# Altium schematic sheet clock-timer-8051.SchDoc
size A3
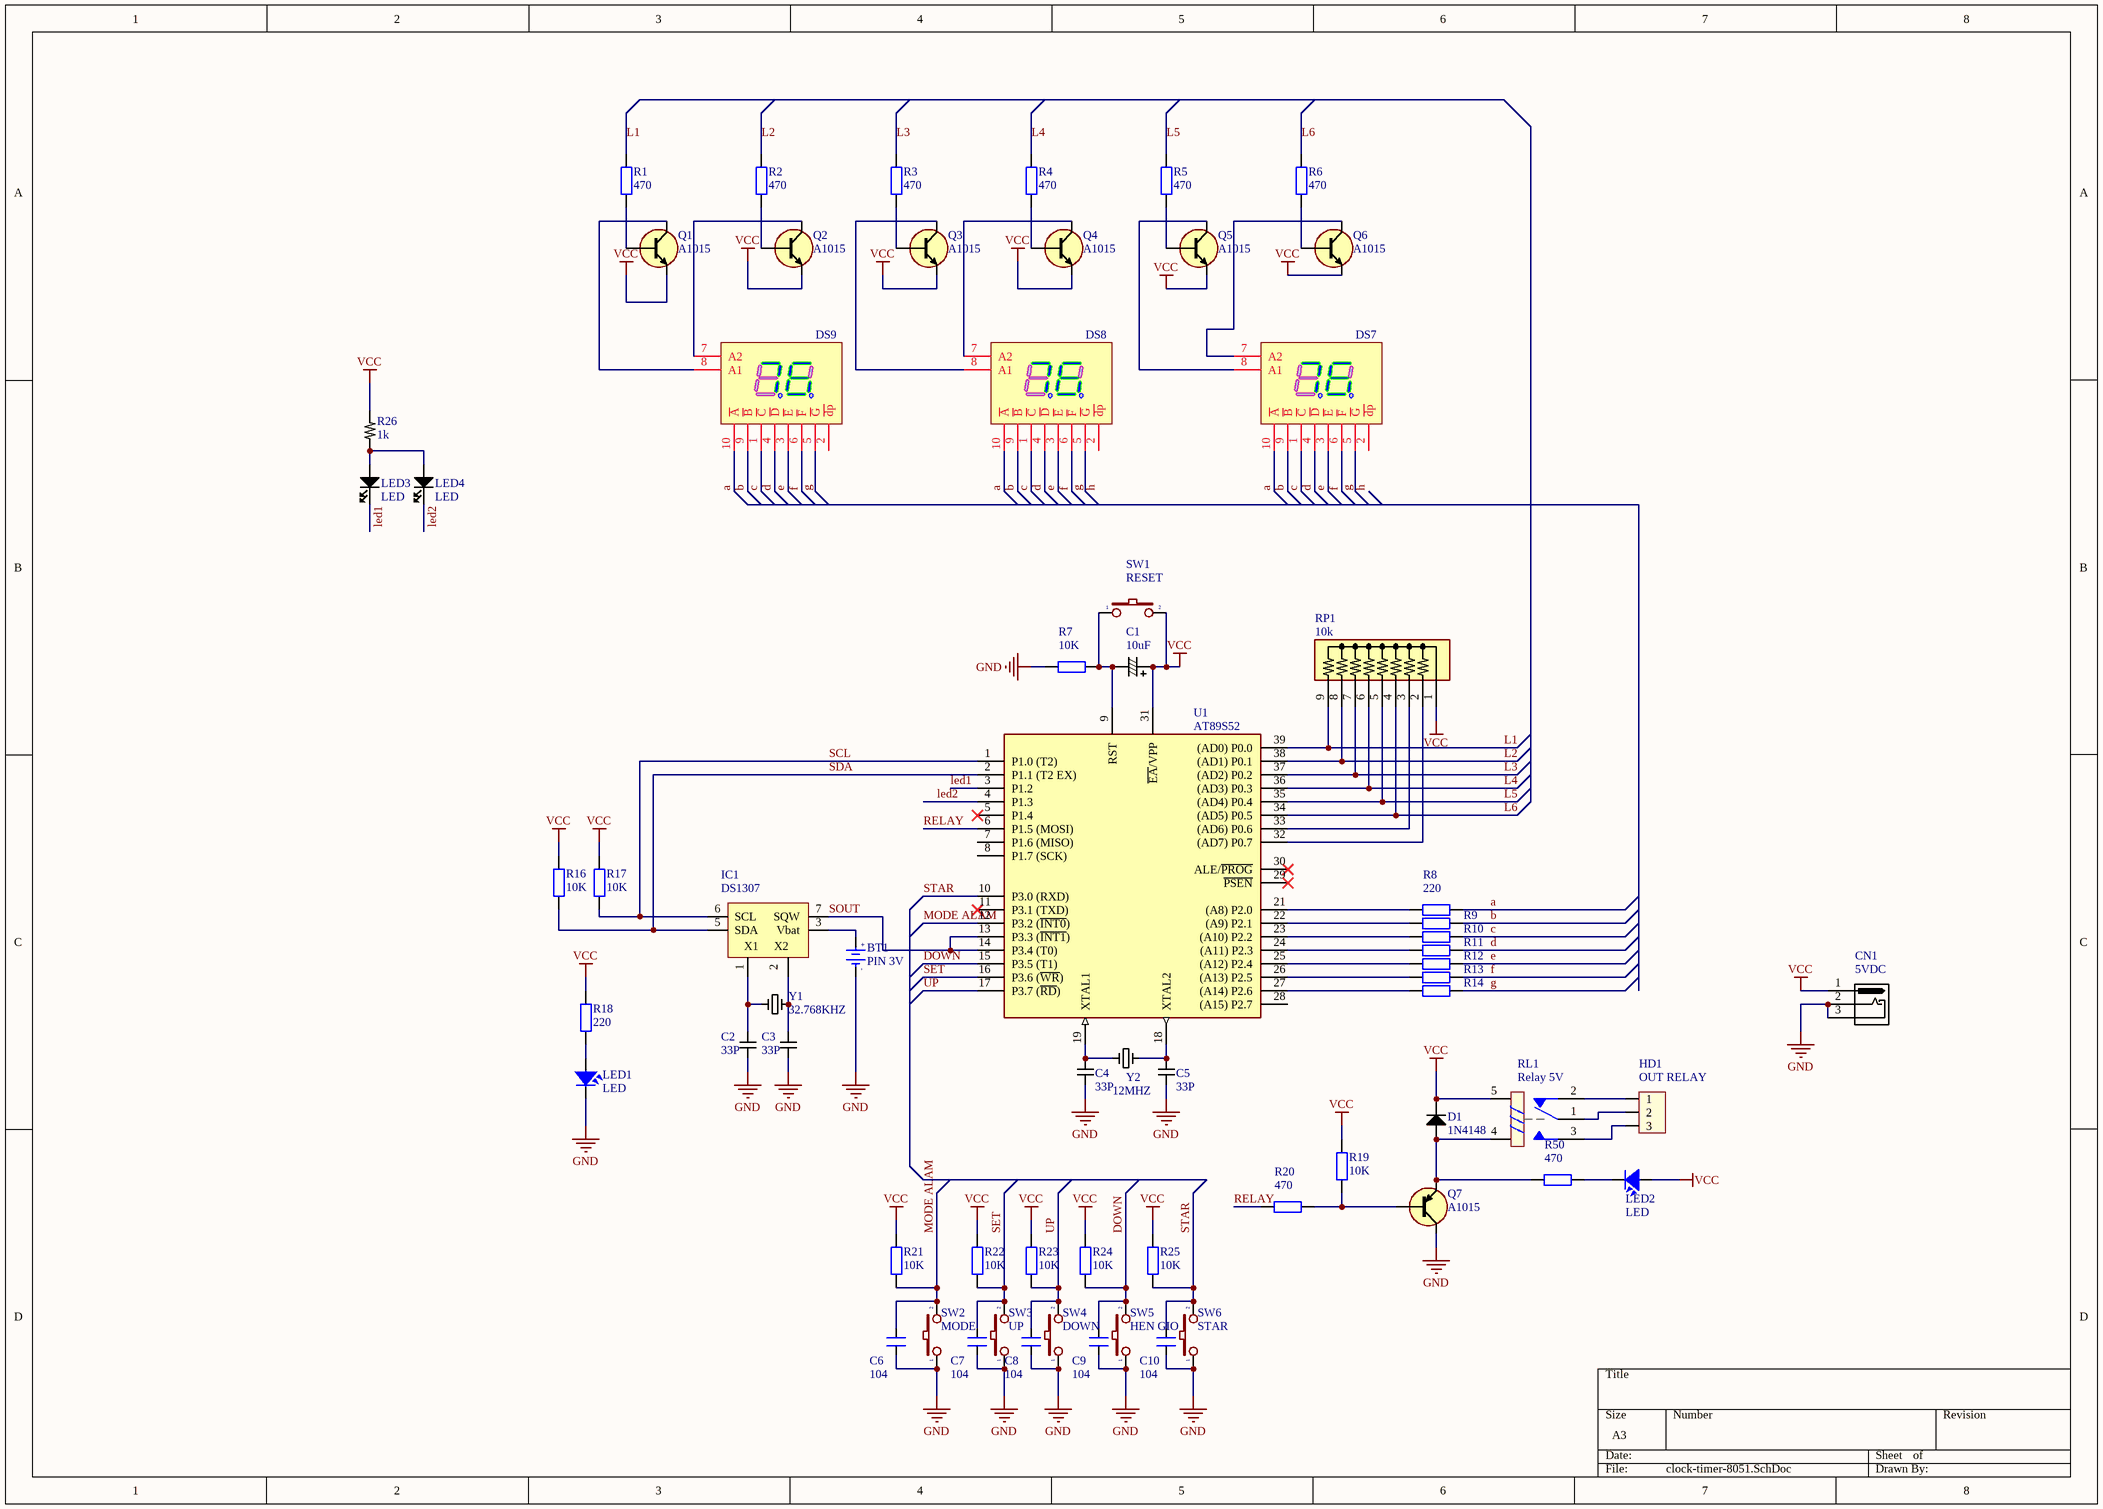
[diagram p0: clock-timer-8051.SchDoc]

## Parts
BT1  PIN 3V  [PIN3V]
C1  10uF  [RB.1/.2H]
C2  33P  [RAD0.1]
C3  33P  [RAD0.1]
C4  33P  [RAD0.1]
C5  33P  [RAD0.1]
C6  104  [CN1.5]
C7  104  [CN1.5]
C8  104  [CN1.5]
C9  104  [CN1.5]
C10  104  [CN1.5]
CN1  5VDC  [DC-IN]
D1  1N4148  [DIODE0.2]
DS7  DUAL DS  [LED 7 SEG_DUAL DS]  (value not drawn)
DS8  DUAL DS  [LED 7 SEG_DUAL DS]  (value not drawn)
DS9  DUAL DS  [LED 7 SEG_DUAL DS]  (value not drawn)
HD1  OUT RELAY  [HED3]
IC1  DS1307  [DIP8/W0.3]
LED1  LED  [LED-3]
LED2  LED  [LED-3]
LED3  LED  [LED.1/.2]
LED4  LED  [LED.1/.2]
Q1  A1015  [TO-92/2]
Q2  A1015  [TO-92/2]
Q3  A1015  [TO-92/2]
Q4  A1015  [TO-92/2]
Q5  A1015  [TO-92/2]
Q6  A1015  [TO-92/2]
Q7  A1015  [TO-92/2]
R1  470  [R1/4W]
R2  470  [R1/4W]
R3  470  [R1/4W]
R4  470  [R1/4W]
R5  470  [R1/4W]
R6  470  [R1/4W]
R7  10K  [R1/4W]
R8  220  [R1/4W]
R9  1k  [R1/4W]  (value not drawn)
R10  1k  [R1/4W]  (value not drawn)
R11  1k  [R1/4W]  (value not drawn)
R12  1k  [R1/4W]  (value not drawn)
R13  1k  [R1/4W]  (value not drawn)
R14  1k  [R1/4W]  (value not drawn)
R16  10K  [R1/4W]
R17  10K  [R1/4W]
R18  220  [R1/4W]
R19  10K  [R1/4W]
R20  470  [R1/4W]
R21  10K  [R1/4W]
R22  10K  [R1/4W]
R23  10K  [R1/4W]
R24  10K  [R1/4W]
R25  10K  [R1/4W]
R26  1k  [AXIAL0.3]
R50  470  [R1/4W]
RL1  Relay 5V  [RL_SPDT_10A]
RP1  10k  [RN8]
SW1  RESET  [SW2]
SW2  MODE  [SW2]
SW3  UP  [SW2]
SW4  DOWN  [SW2]
SW5  HEN GIO  [SW2]
SW6  STAR  [SW2]
U1  AT89S52  [DIP40/W0.6]
Y1  32.768KHZ  [XTAL2]
Y2  12MHZ  [XTAL1]

## Nets
GND: BT1.2(GND) C2.2 C3.2 C4.2 C5.2 C6.1 C7.1 C8.1 C9.1 C10.1 CN1.2 CN1.3 IC1.4(GND) LED1.2 Q7.2(C) R7.1 SW2.1 SW3.1 SW4.1 SW5.1 SW6.1 U1.20(GND)
VCC: C1.1 CN1.1 D1.C IC1.8(VCC) LED2.1 Q1.1(E) Q2.1(E) Q3.1(E) Q4.1(E) Q5.1(E) Q6.1(E) R16.2 R17.2 R18.2 R19.1 R21.1 R22.1 R23.1 R24.1 R25.2 R26.1 RL1.5 RP1.1 SW1.2 U1.31(~{EA}/VPP) U1.40(VCC)
a: DS7.10(~{A}) DS8.10(~{A}) DS9.10(~{A}) R8.2
b: DS7.9(~{B}) DS8.9(~{B}) DS9.9(~{B}) R9.2
c: DS7.1(~{C}) DS8.1(~{C}) DS9.1(~{C}) R10.2
d: DS7.4(~{D}) DS8.4(~{D}) DS9.4(~{D}) R11.2
DOWN: C9.2 R24.2 SW5.2 U1.15(P3.5_(T1))
e: DS7.3(~{E}) DS8.3(~{E}) DS9.3(~{E}) R12.2
f: DS7.6(~{F}) DS8.6(~{F}) DS9.6(~{F}) R13.2
g: DS7.5(~{G}) DS8.5(~{G}) DS9.5(~{G}) R14.2
L1: R1.2 RP1.9 U1.39((AD0)_P0.0)
L2: R2.2 RP1.8 U1.38((AD1)_P0.1)
L3: R3.2 RP1.7 U1.37((AD2)_P0.2)
L4: R4.2 RP1.6 U1.36((AD3)_P0.3)
L5: R5.2 RP1.5 U1.35((AD4)_P0.4)
L6: R6.2 RP1.4 U1.34((AD5)_P0.5)
led1: LED3.K U1.3(P1.2)
led2: LED4.K U1.4(P1.3)
MODE ALAM: C6.2 R21.2 SW2.2 U1.12(P3.2_(~{INT0}))
RELAY: R20.2 U1.6(P1.5_(MOSI))
SCL: IC1.6(SCL) R17.1 U1.1(P1.0_(T2))
SDA: IC1.5(SDA) R16.1 U1.2(P1.1_(T2_EX))
SET: C7.2 R22.2 SW3.2 U1.16(P3.6_(~{WR}))
SOUT: IC1.7(SQW) U1.13(P3.3_(~{INT1})) U1.14(P3.4_(T0))
STAR: C10.2 R25.1 SW6.2 U1.10(P3.0_(RXD))
UP: C8.2 R23.2 SW4.2 U1.17(P3.7_(~{RD}))
NetBT1_1: BT1.1(+3V) IC1.3(Vbat)
NetC1_2: C1.2 R7.2 SW1.1 U1.9(RST)
NetC2_1: C2.1 IC1.1(X1) Y1.1
NetC3_1: C3.1 IC1.2(X2) Y1.2
NetC4_1: C4.1 U1.19(XTAL1) Y2.1
NetC5_1: C5.1 U1.18(XTAL2) Y2.2
NetD1_A: D1.A Q7.1(E) R50.2 RL1.4
NetDS7_7: DS7.7(A2) Q6.2(C)
NetDS7_8: DS7.8(A1) Q5.2(C)
NetDS8_7: DS8.7(A2) Q4.2(C)
NetDS8_8: DS8.8(A1) Q3.2(C)
NetDS9_7: DS9.7(A2) Q2.2(C)
NetDS9_8: DS9.8(A1) Q1.2(C)
NetHD1_1: HD1.1 RL1.2
NetHD1_2: HD1.2 RL1.1
NetHD1_3: HD1.3 RL1.3
NetLED1_1: LED1.1 R18.1
NetLED2_2: LED2.2 R50.1
NetLED3_A: LED3.A LED4.A R26.2
NetQ1_3: Q1.3(B) R1.1
NetQ2_3: Q2.3(B) R2.1
NetQ3_3: Q3.3(B) R3.1
NetQ4_3: Q4.3(B) R4.1
NetQ5_3: Q5.3(B) R5.1
NetQ6_3: Q6.3(B) R6.1
NetQ7_3: Q7.3(B) R19.2 R20.1
NetR8_1: R8.1 U1.21((A8)_P2.0)
NetR9_1: R9.1 U1.22((A9)_P2.1)
NetR10_1: R10.1 U1.23((A10)_P2.2)
NetR11_1: R11.1 U1.24((A11)_P2.3)
NetR12_1: R12.1 U1.25((A12)_P2.4)
NetR13_1: R13.1 U1.26((A13)_P2.5)
NetR14_1: R14.1 U1.27((A14)_P2.6)
NetRP1_2: RP1.2 U1.32((AD7)_P0.7)
NetRP1_3: RP1.3 U1.33((AD6)_P0.6)

Not connected (* = marked no-connect by the designer): DS7 2(~{dp}); DS8 2(~{dp}); DS9 2(~{dp}); U1 5(P1.4)* 7(P1.6_(MISO)) 8(P1.7_(SCK)) 11(P3.1_(TXD))* 28((A15)_P2.7) 29(~{PSEN})* 30(ALE/~{PROG})*

## Notes on the sheet
- Labels drawn without touching a wire or pin: h
- (in symbol PIN 3V) +; -

## Library data of the parts
BT1 = PIN 3V: Battery 3VDC; Value: PIN 3V
C1 = C-POL1
C2-C5 = CAP
C6-C10 = CN1: Cap np  1pF - 472pF; Value: 100pF; Description: Cap np Cremic Value  1pF => 472 pF
CN1 = DC JACK
D1 = DIODE
DS7-DS9 = LED 7 SEG DUAL DS_V1
HD1 = Hed3: Header 3 (Green); Value: Header 3
IC1 = DS1307: Real Timer Serial; Value: DS1307
LED1 LED2 = LED: LED Single colour Green and Red; Value: LED 3 ly Single Colour; Description: LED 5 ly Single Colour; Description: Led  Vuong
Q1-Q6 = NPN ECB
Q7 = PNP ECB
R1-R14 R16-R25 R50 = R1/4W: Resistor 1/4W; Value: R1/4W - 1K
R26 = RES
RL1 = Relay 1: Relay SPDT,10A - 12VDC 5 Pin; Value: Relay SPDT, 10A, 12V
RP1 = RPACK-8
SW1-SW6 = SW2: Switch button 2 pin; Value: SW chip 2 pin
Y1 Y2 = CRYSTAL